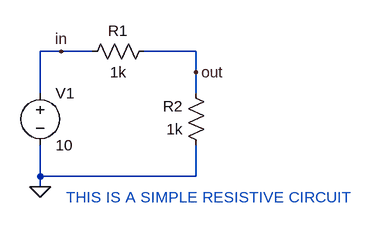
[diagram p0: schematic assignment.asc]
assignment.asc, the LTspice schematic file:
Version 4.1
SHEET 1 880 680
WIRE 48 -496 16 -496
WIRE 96 -496 48 -496
WIRE 256 -496 176 -496
WIRE 256 -464 256 -496
WIRE 16 -432 16 -496
WIRE 256 -432 256 -464
WIRE 16 -304 16 -352
WIRE 256 -304 256 -352
WIRE 256 -304 16 -304
WIRE 16 -288 16 -304
FLAG 16 -288 0
FLAG 256 -464 out
FLAG 48 -496 in
SYMBOL res 192 -512 R90
WINDOW 0 0 56 VBottom 2
WINDOW 3 32 56 VTop 2
SYMATTR InstName R1
SYMATTR Value 1k
SYMBOL res 272 -336 R180
WINDOW 0 36 76 Left 2
WINDOW 3 36 40 Left 2
SYMATTR InstName R2
SYMATTR Value 1k
SYMBOL voltage 16 -448 R0
WINDOW 123 0 0 Left 0
WINDOW 39 0 0 Left 0
SYMATTR InstName V1
SYMATTR Value 10
TEXT 56 -272 Left 2 ;THIS IS A SIMPLE RESISTIVE CIRCUIT

The netlist it stands for:
* assignment.asc
R1 out in 1k
R2 0 out 1k
V1 in 0 10
* THIS IS A SIMPLE RESISTIVE CIRCUIT
.backanno
.end